# EAGLE design I2C-Oled-Backpack-Newhaven (EAGLE 9.5.2)
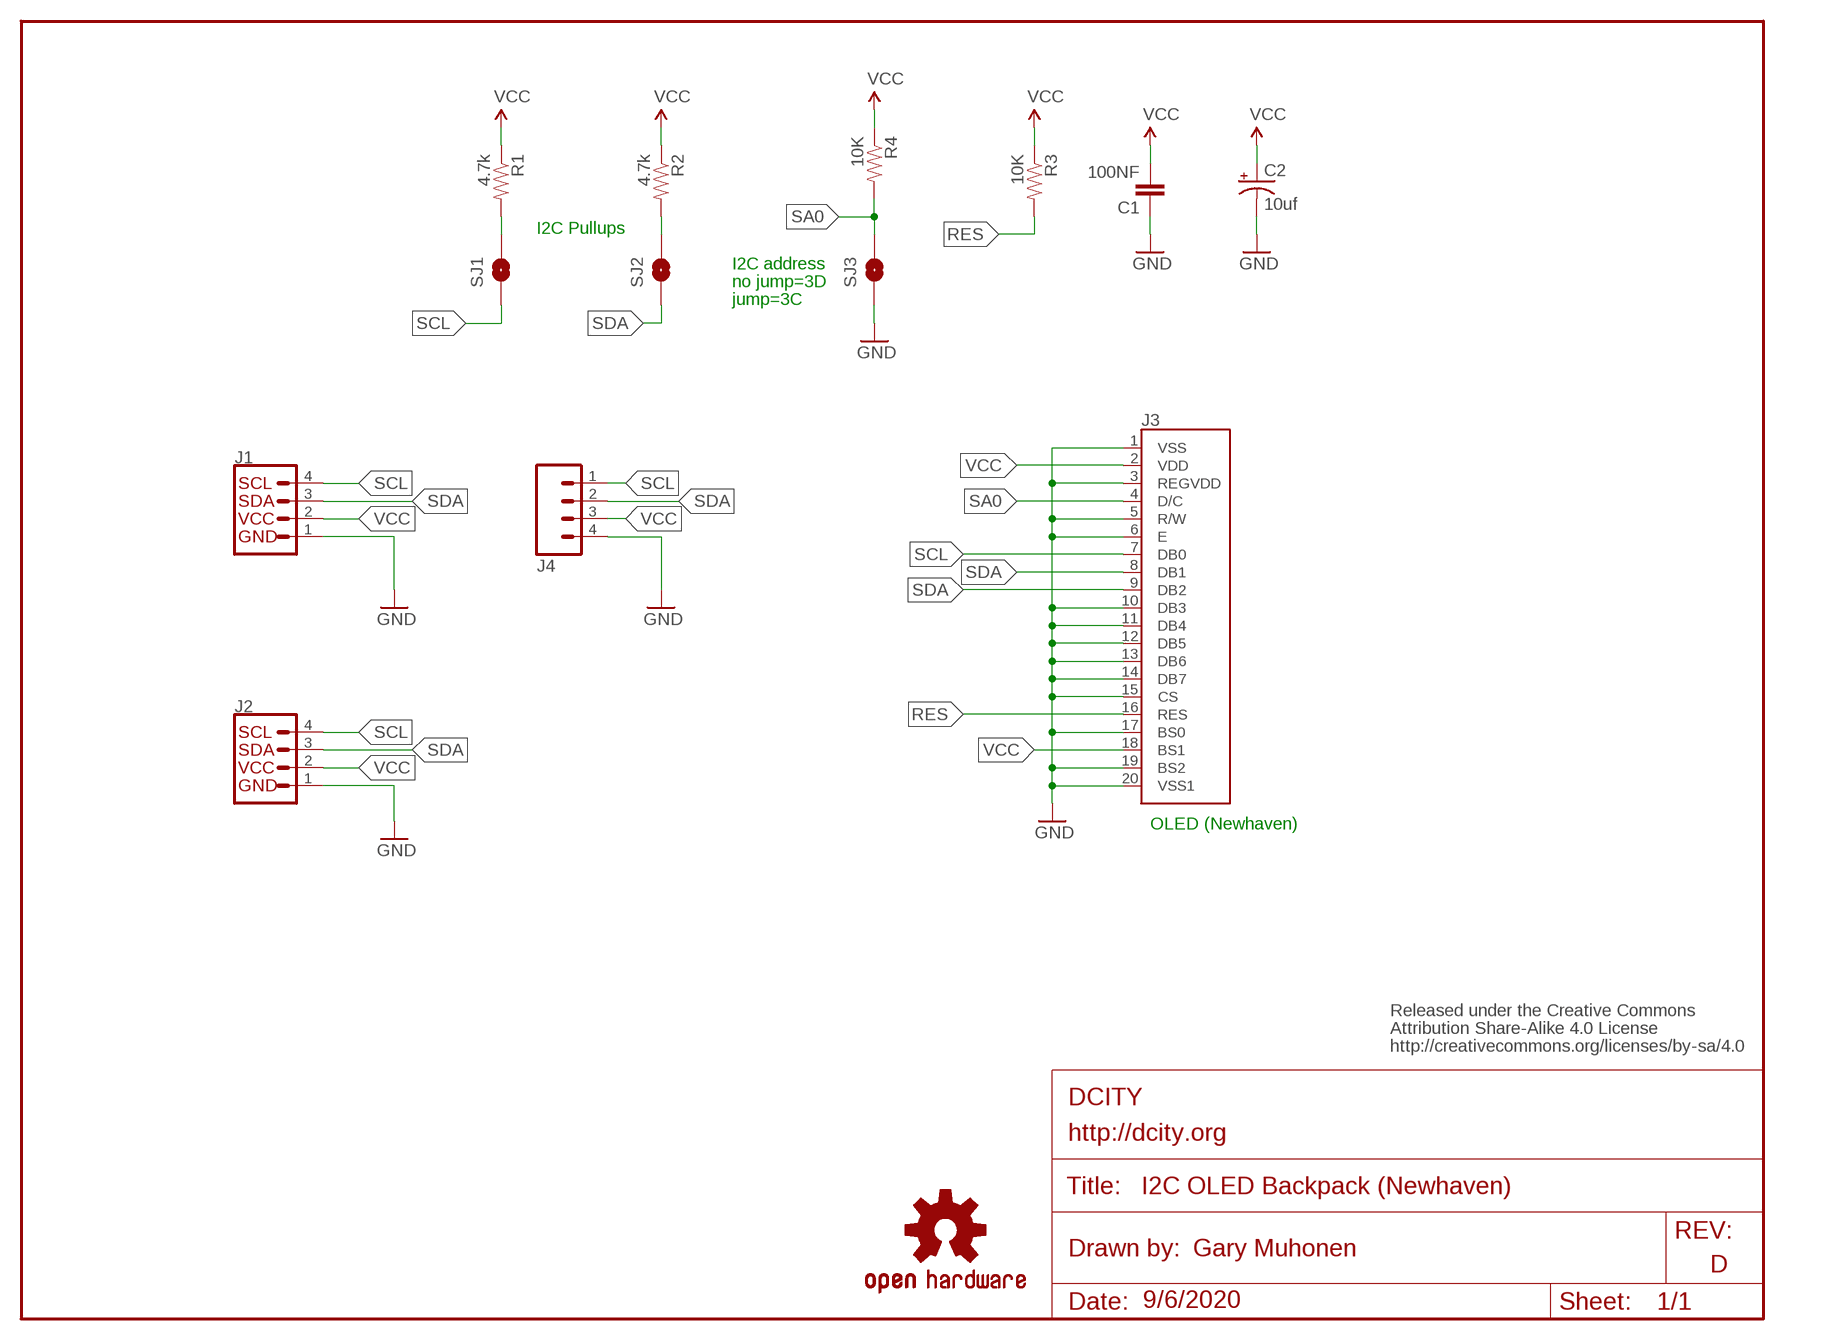
[diagram p0: schematic, sheet 1]
U$1 (DOCFIELD-WHT): COMPANYNAME: DCITY; COMPANYWEBSITE: http://dcity.org; DATE: 9/6/2020; DRAWNBY: Gary Muhonen; TITLE: I2C OLED Backpack (Newhaven); VERSION: D

## Parts
C1  100NF  CAP0805  [0805-CAP]
C2  10uf  CAP_POL0805  [0805-POL]
J1  QWIIC_RIGHT_ANGLE  QWIIC_CONNECTORJS-1MM  [JST04_1MM_RA]
J2  QWIIC_RIGHT_ANGLE  QWIIC_CONNECTORJS-1MM  [JST04_1MM_RA]
J3  LCD-NEWHAVEN-LOCK  [1X20_LOCK]
J4  M04LOCK  [1X04_LOCK]
LOGO1  OSHW-LOGOS  [OSHW-LOGO-S]
R1  4.7k  RESISTOR0805  [0805-RES]
R2  4.7k  RESISTOR0805  [0805-RES]
R3  10K  RESISTOR0805  [0805-RES]
R4  10K  RESISTOR0805  [0805-RES]
SJ1  SOLDERJUMPERNC  [SJ_2S]
SJ2  SOLDERJUMPERNC  [SJ_2S]
SJ3  SOLDERJUMPERNC  [SJ_2S]
U$2  CREATIVE_COMMONS  [CREATIVE_COMMONS]

## Nets
GND: C1.1 C2.- J1.1 J2.1 J3.1(VSS) J3.3(REGVDD) J3.5(R/W) J3.6(E) J3.10(DB3) J3.11(DB4) J3.12(DB5) J3.13(DB6) J3.14(DB7) J3.15(CS) J3.17(BS0) J3.19(BS2) J3.20(VSS1) J4.4 SJ3.1
N$1: R1.2 SJ1.2
N$2: R2.2 SJ2.2
RES: J3.16(RES) R3.2
SA0: J3.4(D/C) R4.2 SJ3.2
SCL: J1.4 J2.4 J3.7(DB0) J4.1 SJ1.1
SDA: J1.3 J2.3 J3.8(DB1) J3.9(DB2) J4.2 SJ2.1
VCC: C1.2 C2.+ J1.2 J2.2 J3.2(VDD) J3.18(BS1) J4.3 R1.1 R2.1 R3.1 R4.1

## Notes on the sheet
- I2C Pullups
- I2C address
- no jump=3D
- jump=3C
- OLED (Newhaven)

## Library data of the parts
C1 = 0:CAP: Capacitor Standard 0603 ceramic capacitor, and 0.1" leaded capacitor.
C2 = 0:CAP_POL: Capacitor Polarized These are standard SMD and PTH capacitors. Normally 10uF, 47uF, and 100uF in electrolytic and tantalum varieties. Always verify the external diameter of the through hole cap, it varies with capacity, voltage, and manufacturer. The EIA devices should be standard.
J1 J2 = 0:QWIIC_CONNECTOR: SparkFun I2C Standard Qwiic Connector An SMD 1mm pitch JST connector makes it easy and quick (get it? Qwiic?) to connect I2C devices to each other. The Qwiic system <http://www.sparkfun.com/qwiic> enables fast and solderless connection between popular platforms and various sensors and actuators. We carry 200mm <https://www.sparkfun.com/products/14204>, 100mm <https://www.sparkfun.com/products/14205>, 50mm <https://www.sparkfun.com/products/14206>, and breadboard friendly <https://www.sparkfun.com/products/14207> Qwiic cables. We also offer 10 pcs strips <https://www.sparkfun.com/products/14323> the SMD connectors.; PROD_ID: CONN-13694
J3 = 0:LCD-NEWHAVEN
J4 = 0:M04: Header 4 Standard 4-pin 0.1" header. Use with straight break away headers (SKU : PRT-00116), right angle break away headers (PRT-00553), swiss pins (PRT-00743), machine pins (PRT-00117), and female headers (PRT-00115). Molex polarized connector foot print use with SKU : PRT-08231 with associated crimp pins and housings.
LOGO1 = 0 - Seeedstudio:OSHW-LOGO: Open Source Hardware Logo This logo indicates the piece of hardware it is found on incorporates a OSHW license and/or adheres to the definition of open source hardware found here: http://freedomdefined.org/OSHW
R1-R4 = 0:RESISTOR: Resistor Basic schematic elements and footprints for 0603, 1206, and PTH 1/10th watt (small) resistors.
SJ1-SJ3 = 0:SOLDERJUMPER: Solder Jumper Standard SMD solder jumper. Used to automate production. Two varients : Normally Open and Normally Closed are the same, but have different paste layers. NC will have a large amount of paste and should jumper during reflow.
U$2 = 0:CREATIVE_COMMONS

## Board
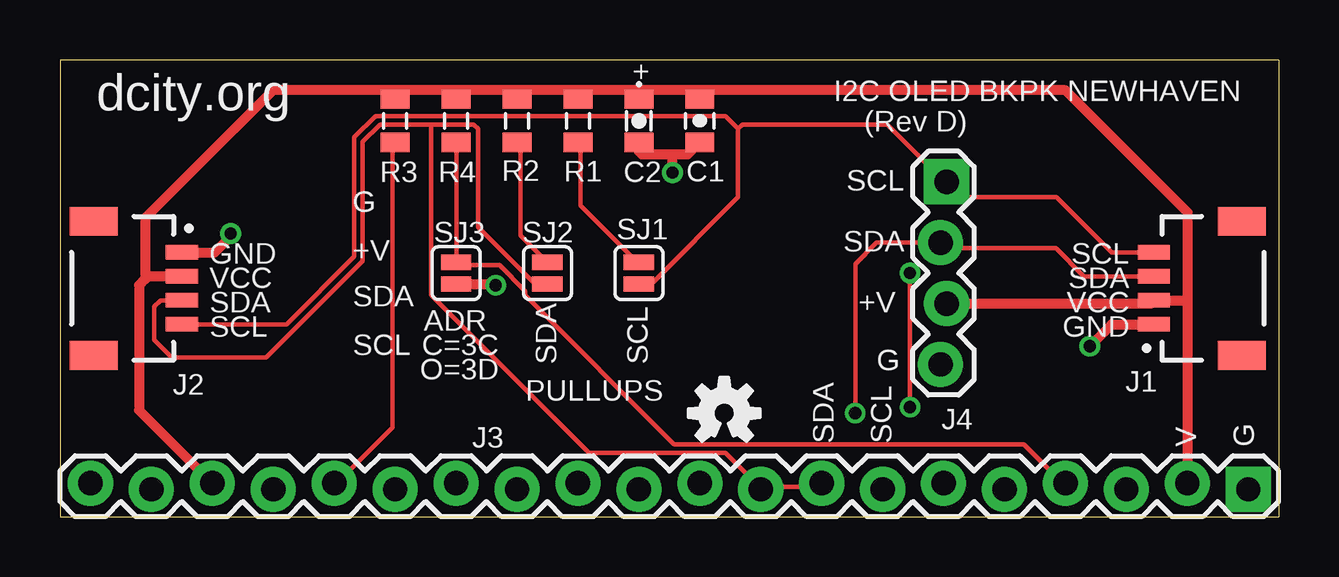
[diagram p1: board, top side]
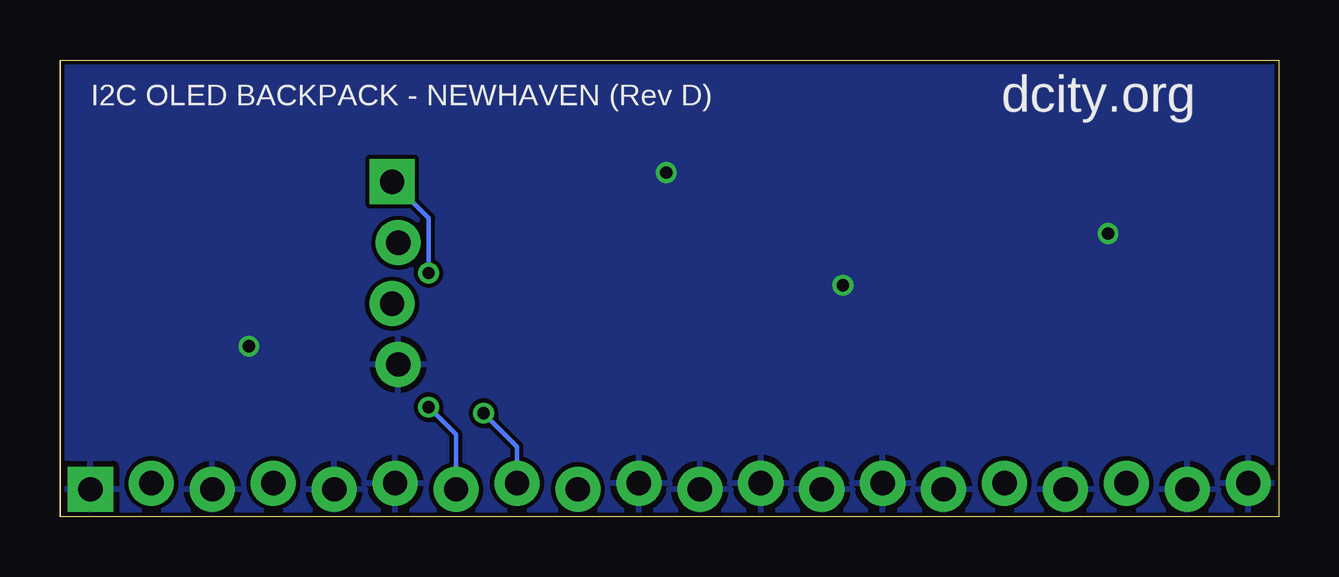
[diagram p2: board, bottom side, seen from below]

Size 50.8 x 19.05 mm. Coordinates in mm from the lower left corner, seen from the top.
Outline: 0,0 50.8,0 50.8,19.05 0,19.05 0,0
Copper layers (1*16): Top 0.035mm / dielectric 1.5mm / Bottom 0.035mm
Design rules "7mils-gary": minimum track width 7mil, minimum drill 20mil, track to track 7mil, track to pad 7mil, pad to pad 7mil, via to via 7mil, smd to smd 7mil, copper to edge 7mil, drill to drill 7mil, minimum pad ring 7mil, minimum via ring 7mil, stop-mask expansion 4mil, vias tented up to drill 25mil, thermal gap 10mil
vRestrict: area 13.1,13.8 to 14.7,15; area 15.6,13.8 to 17.2,15.1; area 18.2,13.7 to 19.8,15; area 20.8,13.8 to 22.4,15.1; area 23.3,13.6 to 25,15; area 26,13.7 to 27.5,15; area 32.5,13.3 to 35,14.8; area 32.5,10.8 to 35,12; area 33,8.4 to 34.9,9.6; area 33.5,5.8 to 35,7.3; area 23.4,6.1 to 24.8,8.8; area 19.7,6.1 to 20.9,8.8; 18 more areas

### Footprints (pad centres in the part's own frame; a part is rotated, then mirrored left to right if it is on the bottom)
0805-CAP = smd 0.8 x 1.2: 1 -0.9,0; 2 0.9,0
0805-POL = smd 0.8 x 1.2: + 0.9,0; - -0.9,0
JST04_1MM_RA = smd 0.6 x 1.35: 1 -1.5,0; 2 -0.5,0; 3 0.5,0; 4 1.5,0 | smd 1.2 x 2: NC1 2.8,-3.675; NC2 -2.8,-3.675
1X20_LOCK = drill 1.016 pad 1.88 square: 1 0,0.127 | drill 1.016 pad 1.88: 2 2.54,-0.127; 3 5.08,0.127; 4 7.62,-0.127; 5 10.16,0.127; 6 12.7,-0.127; 7 15.24,0.127; 8 17.78,-0.127; 9 20.32,0.127; 10 22.86,-0.127; 11 25.4,0.127; 12 27.94,-0.127; 13 30.48,0.127; 14 33.02,-0.127; 15 35.56,0.127; 16 38.1,-0.127; 17 40.64,0.127; 18 43.18,-0.127; 19 45.72,0.127; 20 48.26,-0.127
1X04_LOCK = drill 1.016 pad 1.88 square: 1 0,0.127 | drill 1.016 pad 1.88: 2 2.54,-0.127; 3 5.08,0.127; 4 7.62,-0.127
0805-RES = smd 0.8 x 1.2: 1 -0.9,0; 2 0.9,0
SJ_2S = smd 0.635 x 1.27: 1 -0.45,0; 2 0.45,0

### Placement (x,y rotation side)
C1  26.67,16.51 90 top
C2  24.13,16.51 90 top
J1  45.59,9.53 90 top
J2  5.08,9.53 270 top
J3  49.53,1.27 180 top
J4  36.83,13.97 270 top
LOGO1  27.69,4.32 0 top
R1  21.59,16.51 270 top
R2  19.05,16.51 270 top
R3  13.97,16.51 270 top
R4  16.51,16.51 270 top
SJ1  24.13,10.16 90 top
SJ2  20.32,10.16 90 top
SJ3  16.51,10.16 90 top
U$2  0,20.32 0 top

### Tracks (layer width: path | path; a pad name or v marks a point on that pad's centre or on a via)
GND  (via drill 0.51)
  Top 0.406: SJ3.1 18.1,9.71 v18.16,9.65 | C2.- 24.13,15.24 24.26,15.11 25.53,15.11 | 25.53,15.11 26.17,15.11 C1.1 | v25.53,14.35 25.53,15.11 | 42.88,7.11 42.93,7.16 v42.93,7.11 43.84,8.03 J1.1 | J2.1 6.45,11.03 7.11,11.68 v7.11,11.81
  pour Bottom: 0,0 50.8,0 50.8,19.05 0,19.05
N$1
  Top 0.178: R1.2 21.69,15.47 21.69,12.98 24,10.67 SJ1.2
N$2
  Top 0.178: R2.2 19.2,15.47 19.2,11.73 20.27,10.67 SJ2.2
RES
  Top 0.178: R3.2 13.87,15.47 13.87,3.73 11.56,1.42 J3.16
SA0
  Top 0.178: R4.2 16.54,15.47 16.54,10.67 SJ3.2 16.54,10.49 18.31,10.49 19.38,9.42 19.38,9.25 25.6,3.02 40.18,3.02 41.78,1.42 J3.4
SCL  (via drill 0.51)
  Top 0.178: 28.27,16.18 28.27,13.34 24.71,9.78 24.18,9.78 SJ1.1 | 28.27,16.18 28.45,16.36 34.49,16.36 36.8,14.05 J4.1 36.98,13.87 37.52,13.34 41.53,13.34 43.84,11.03 J1.4 | 28.27,16.18 27.74,16.71 13.16,16.71 12.27,15.82 12.27,10.85 9.45,8.03 J2.4 | v35.43,4.57 v35.43,10.16
  Bottom 0.178: J3.7 34.29,3.43 v35.43,4.57 | v35.43,10.16 35.43,12.45 J4.1
SDA  (via drill 0.51)
  Top 0.178: 15.47,16.36 13.34,16.36 12.62,15.65 12.62,10.67 8.6,6.64 4.66,6.64 3.94,7.37 3.94,8.76 4.2,9.03 J2.3 | 15.47,16.36 17.25,16.36 17.42,16.18 17.42,12.09 19.74,9.78 20.27,9.78 SJ2.1 | J3.8 31.65,1.25 29.34,1.25 J3.9 29.16,1.25 27.74,2.67 22.05,2.67 15.47,9.25 15.47,16.36 | v33.15,4.32 33.15,10.54 34.04,11.43 J4.2 36.8,11.38 36.98,11.2 41.5,11.2 42.68,10.03 J1.3
  Bottom 0.178: J3.8 31.75,2.92 v33.15,4.32
VCC
  Top 0.406: J4.3 38.1,8.89 38.35,8.89 45.46,8.89 J1.2 46.98,9.03 46.99,9.02 | 26.67,17.78 41.91,17.78 46.99,12.7 46.99,9.02 | 26.67,17.78 24.13,17.78 | 24.13,17.78 21.59,17.78 | 21.59,17.78 19.05,17.78 | 19.05,17.78 16.51,17.78 | 16.51,17.78 13.97,17.78 | 13.97,17.78 8.89,17.78 3.56,12.45 3.56,9.91 | R3.1 13.97,17.78 | R4.1 16.51,17.78 | R2.1 19.05,17.78 | R1.1 21.59,17.78 | C2.+ 24.13,17.78 | C1.2 26.67,17.78 | J3.18 3.3,4.45 3.3,9.65 3.56,9.91 | J2.2 3.67,10.03 3.56,9.91 | 46.99,9.02 J3.2

### Text on the board
tPlace: + | dcity.org | I2C OLED BKPK NEWHAVEN | (Rev D) | SCL | G | GND | +V | SDA | SCL | VCC | SDA | SDA | SDA | ADR | +V | VCC | C=3C | GND | SCL | SCL | O=3D | SDA | SCL | PULLUPS | G | SDA | SCL | V | G
bPlace: dcity.org | I2C OLED BACKPACK - NEWHAVEN (Rev D)